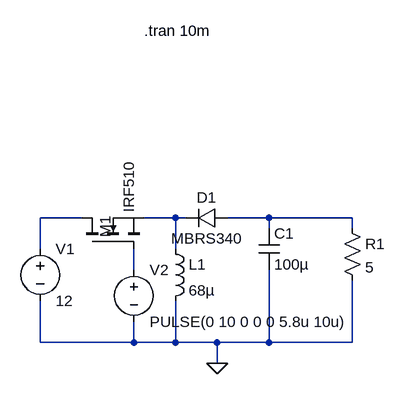
[diagram p0: schematic boostConverterSchematic.asc]
boostConverterSchematic.asc, the LTspice schematic file:
Version 4.1
SHEET 1 880 680
WIRE 112 80 48 80
WIRE 256 80 208 80
WIRE 272 80 256 80
WIRE 400 80 336 80
WIRE 528 80 400 80
WIRE 400 96 400 80
WIRE 528 96 528 80
WIRE 48 128 48 80
WIRE 256 128 256 80
WIRE 192 160 192 128
WIRE 48 272 48 208
WIRE 192 272 192 240
WIRE 192 272 48 272
WIRE 256 272 256 208
WIRE 256 272 192 272
WIRE 320 272 256 272
WIRE 400 272 400 160
WIRE 400 272 320 272
WIRE 528 272 528 176
WIRE 528 272 400 272
WIRE 320 304 320 272
FLAG 320 304 0
SYMBOL voltage 48 112 R0
WINDOW 123 0 0 Left 0
WINDOW 39 0 0 Left 0
SYMATTR InstName V1
SYMATTR Value 12
SYMBOL ind 240 112 R0
SYMATTR InstName L1
SYMATTR Value 68µ
SYMBOL nmos 112 128 R270
WINDOW 0 17 36 Left 2
SYMATTR InstName M1
SYMATTR Value IRF510
SYMBOL diode 336 64 R90
WINDOW 0 0 32 VBottom 2
WINDOW 3 32 32 VTop 2
SYMATTR InstName D1
SYMATTR Value MBRS340
SYMATTR Description Diode
SYMATTR Type diode
SYMBOL cap 384 96 R0
SYMATTR InstName C1
SYMATTR Value 100µ
SYMBOL res 512 80 R0
SYMATTR InstName R1
SYMATTR Value 5
SYMBOL voltage 192 144 R0
WINDOW 123 0 0 Left 0
WINDOW 39 0 0 Left 0
SYMATTR InstName V2
SYMATTR Value PULSE(0 10 0 0 0 5.8u 10u)
TEXT 208 -208 Left 2 !.tran 10m

The netlist it stands for:
* boostConverterSchematic.asc
V1 N001 0 12
L1 N002 0 68µ
M1 N001 N004 N002 N002 IRF510
D1 N003 N002 MBRS340
C1 N003 0 100µ
R1 N003 0 5
V2 N004 0 PULSE(0 10 0 0 0 5.8u 10u)
.model D D
.lib standard.dio
.model NMOS NMOS
.model PMOS PMOS
.lib standard.mos
.tran 10m
.backanno
.end